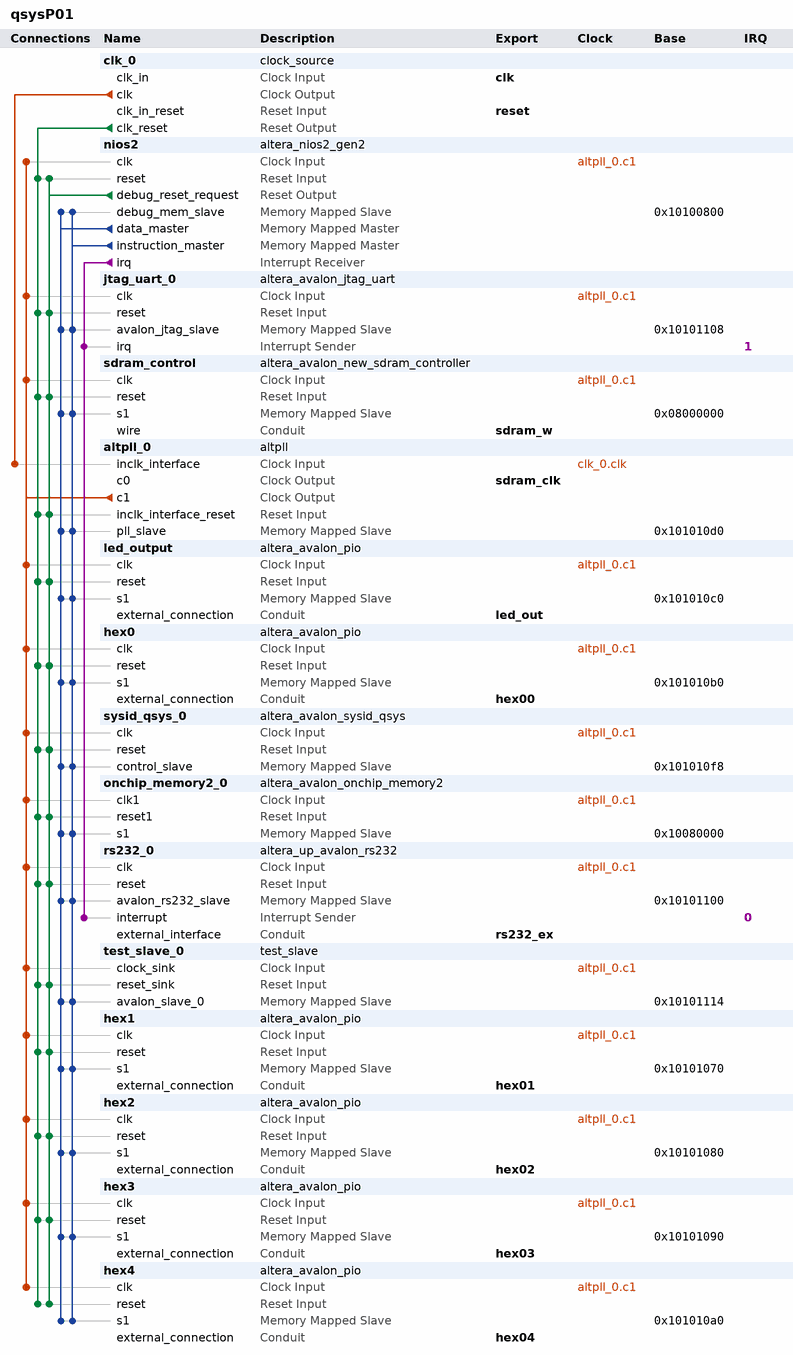
[diagram p0: system contents]
# Platform Designer (Qsys) system qsysP01, Cyclone IV E EP4CE115F29C7
# Parameters at their usual value, and those the tool derives, are not listed.
package require -exact qsys 15.0
create_system qsysP01
set_project_property DEVICE_FAMILY {Cyclone IV E}
set_project_property DEVICE EP4CE115F29C7

add_instance clk_0 clock_source 15.0
set_instance_parameter_value clk_0 clockFrequency 50000000

add_instance nios2 altera_nios2_gen2 15.0
set_instance_parameter_value nios2 dcache_size 2048
set_instance_parameter_value nios2 exceptionSlave onchip_memory2_0.s1
set_instance_parameter_value nios2 icache_size 4096
set_instance_parameter_value nios2 impl Fast
set_instance_parameter_value nios2 resetSlave onchip_memory2_0.s1

add_instance jtag_uart_0 altera_avalon_jtag_uart 15.0
set_instance_parameter_value jtag_uart_0 simInteractiveOptions NO_INTERACTIVE_WINDOWS

add_instance sdram_control altera_avalon_new_sdram_controller 15.0
set_instance_parameter_value sdram_control TAC 5.5
set_instance_parameter_value sdram_control TRCD 20.0
set_instance_parameter_value sdram_control TRP 20.0
set_instance_parameter_value sdram_control casLatency 3
set_instance_parameter_value sdram_control columnWidth 10
set_instance_parameter_value sdram_control dataWidth 32
set_instance_parameter_value sdram_control generateSimulationModel false
set_instance_parameter_value sdram_control model single_Micron_MT48LC4M32B2_7_chip
set_instance_parameter_value sdram_control numberOfBanks 4
set_instance_parameter_value sdram_control numberOfChipSelects 1
set_instance_parameter_value sdram_control powerUpDelay 100.0
set_instance_parameter_value sdram_control refreshPeriod 15.625
set_instance_parameter_value sdram_control rowWidth 13

add_instance altpll_0 altpll 15.0
set_instance_parameter_value altpll_0 CLK0_DIVIDE_BY 2
set_instance_parameter_value altpll_0 CLK0_MULTIPLY_BY 3
set_instance_parameter_value altpll_0 CLK0_PHASE_SHIFT -3000
set_instance_parameter_value altpll_0 CLK1_DIVIDE_BY 2
set_instance_parameter_value altpll_0 CLK1_DUTY_CYCLE 50
set_instance_parameter_value altpll_0 CLK1_MULTIPLY_BY 3
set_instance_parameter_value altpll_0 CLK1_PHASE_SHIFT 0
set_instance_parameter_value altpll_0 INCLK0_INPUT_FREQUENCY 20000
set_instance_parameter_value altpll_0 PORT_ARESET PORT_UNUSED
set_instance_parameter_value altpll_0 PORT_LOCKED PORT_UNUSED
set_instance_parameter_value altpll_0 PORT_clk1 PORT_USED
set_instance_parameter_value altpll_0 PORT_clk2 PORT_UNUSED
set_instance_parameter_value altpll_0 PORT_clk3 PORT_UNUSED

add_instance led_output altera_avalon_pio 15.0
set_instance_parameter_value led_output direction Output
set_instance_parameter_value led_output width 18

add_instance hex0 altera_avalon_pio 15.0
set_instance_parameter_value hex0 direction Output
set_instance_parameter_value hex0 width 7

add_instance sysid_qsys_0 altera_avalon_sysid_qsys 15.0
set_instance_parameter_value sysid_qsys_0 id 0

add_instance onchip_memory2_0 altera_avalon_onchip_memory2 15.0
set_instance_parameter_value onchip_memory2_0 dataWidth 32
set_instance_parameter_value onchip_memory2_0 dualPort false
set_instance_parameter_value onchip_memory2_0 initMemContent true
set_instance_parameter_value onchip_memory2_0 initializationFileName "C:\\Users\\cynthialiu\\Desktop\\project01\\qsys\\software\\nios01\\mem_init\\qsysP01_onchip_memory2_0.hex"
set_instance_parameter_value onchip_memory2_0 memorySize 409600
set_instance_parameter_value onchip_memory2_0 useNonDefaultInitFile true

add_instance rs232_0 altera_up_avalon_rs232 15.0
set_instance_parameter_value rs232_0 baud 115200
set_instance_parameter_value rs232_0 parity None

add_instance test_slave_0 test_slave 1.0
set_instance_parameter_value test_slave_0 DATA_WIDTH 32

add_instance hex1 altera_avalon_pio 15.0
set_instance_parameter_value hex1 direction Output
set_instance_parameter_value hex1 width 7

add_instance hex2 altera_avalon_pio 15.0
set_instance_parameter_value hex2 direction Output
set_instance_parameter_value hex2 width 7

add_instance hex3 altera_avalon_pio 15.0
set_instance_parameter_value hex3 direction Output
set_instance_parameter_value hex3 width 7

add_instance hex4 altera_avalon_pio 15.0
set_instance_parameter_value hex4 direction Output
set_instance_parameter_value hex4 width 7

# connections
add_connection altpll_0.c1 hex0.clk clock
add_connection altpll_0.c1 hex1.clk clock
add_connection altpll_0.c1 hex2.clk clock
add_connection altpll_0.c1 hex3.clk clock
add_connection altpll_0.c1 hex4.clk clock
add_connection altpll_0.c1 jtag_uart_0.clk clock
add_connection altpll_0.c1 led_output.clk clock
add_connection altpll_0.c1 nios2.clk clock
add_connection altpll_0.c1 onchip_memory2_0.clk1 clock
add_connection altpll_0.c1 rs232_0.clk clock
add_connection altpll_0.c1 sdram_control.clk clock
add_connection altpll_0.c1 sysid_qsys_0.clk clock
add_connection altpll_0.c1 test_slave_0.clock_sink clock
add_connection clk_0.clk altpll_0.inclk_interface clock
add_connection clk_0.clk_reset altpll_0.inclk_interface_reset reset
add_connection clk_0.clk_reset hex0.reset reset
add_connection clk_0.clk_reset hex1.reset reset
add_connection clk_0.clk_reset hex2.reset reset
add_connection clk_0.clk_reset hex3.reset reset
add_connection clk_0.clk_reset hex4.reset reset
add_connection clk_0.clk_reset jtag_uart_0.reset reset
add_connection clk_0.clk_reset led_output.reset reset
add_connection clk_0.clk_reset nios2.reset reset
add_connection clk_0.clk_reset onchip_memory2_0.reset1 reset
add_connection clk_0.clk_reset rs232_0.reset reset
add_connection clk_0.clk_reset sdram_control.reset reset
add_connection clk_0.clk_reset sysid_qsys_0.reset reset
add_connection clk_0.clk_reset test_slave_0.reset_sink reset
add_connection nios2.debug_reset_request altpll_0.inclk_interface_reset reset
add_connection nios2.debug_reset_request hex0.reset reset
add_connection nios2.debug_reset_request hex1.reset reset
add_connection nios2.debug_reset_request hex2.reset reset
add_connection nios2.debug_reset_request hex3.reset reset
add_connection nios2.debug_reset_request hex4.reset reset
add_connection nios2.debug_reset_request jtag_uart_0.reset reset
add_connection nios2.debug_reset_request led_output.reset reset
add_connection nios2.debug_reset_request nios2.reset reset
add_connection nios2.debug_reset_request onchip_memory2_0.reset1 reset
add_connection nios2.debug_reset_request rs232_0.reset reset
add_connection nios2.debug_reset_request sdram_control.reset reset
add_connection nios2.debug_reset_request sysid_qsys_0.reset reset
add_connection nios2.debug_reset_request test_slave_0.reset_sink reset
add_connection nios2.data_master altpll_0.pll_slave avalon
set_connection_parameter_value nios2.data_master/altpll_0.pll_slave baseAddress 0x101010d0
add_connection nios2.data_master hex0.s1 avalon
set_connection_parameter_value nios2.data_master/hex0.s1 baseAddress 0x101010b0
add_connection nios2.data_master hex1.s1 avalon
set_connection_parameter_value nios2.data_master/hex1.s1 baseAddress 0x10101070
add_connection nios2.data_master hex2.s1 avalon
set_connection_parameter_value nios2.data_master/hex2.s1 baseAddress 0x10101080
add_connection nios2.data_master hex3.s1 avalon
set_connection_parameter_value nios2.data_master/hex3.s1 baseAddress 0x10101090
add_connection nios2.data_master hex4.s1 avalon
set_connection_parameter_value nios2.data_master/hex4.s1 baseAddress 0x101010a0
add_connection nios2.data_master jtag_uart_0.avalon_jtag_slave avalon
set_connection_parameter_value nios2.data_master/jtag_uart_0.avalon_jtag_slave baseAddress 0x10101108
add_connection nios2.data_master led_output.s1 avalon
set_connection_parameter_value nios2.data_master/led_output.s1 baseAddress 0x101010c0
add_connection nios2.data_master nios2.debug_mem_slave avalon
set_connection_parameter_value nios2.data_master/nios2.debug_mem_slave baseAddress 0x10100800
add_connection nios2.data_master onchip_memory2_0.s1 avalon
set_connection_parameter_value nios2.data_master/onchip_memory2_0.s1 baseAddress 0x10080000
add_connection nios2.data_master rs232_0.avalon_rs232_slave avalon
set_connection_parameter_value nios2.data_master/rs232_0.avalon_rs232_slave baseAddress 0x10101100
add_connection nios2.data_master sdram_control.s1 avalon
set_connection_parameter_value nios2.data_master/sdram_control.s1 baseAddress 0x08000000
add_connection nios2.data_master sysid_qsys_0.control_slave avalon
set_connection_parameter_value nios2.data_master/sysid_qsys_0.control_slave baseAddress 0x101010f8
add_connection nios2.data_master test_slave_0.avalon_slave_0 avalon
set_connection_parameter_value nios2.data_master/test_slave_0.avalon_slave_0 baseAddress 0x10101114
add_connection nios2.instruction_master altpll_0.pll_slave avalon
set_connection_parameter_value nios2.instruction_master/altpll_0.pll_slave baseAddress 0x101010d0
add_connection nios2.instruction_master hex0.s1 avalon
set_connection_parameter_value nios2.instruction_master/hex0.s1 baseAddress 0x101010b0
add_connection nios2.instruction_master hex1.s1 avalon
set_connection_parameter_value nios2.instruction_master/hex1.s1 baseAddress 0x10101070
add_connection nios2.instruction_master hex2.s1 avalon
set_connection_parameter_value nios2.instruction_master/hex2.s1 baseAddress 0x10101080
add_connection nios2.instruction_master hex3.s1 avalon
set_connection_parameter_value nios2.instruction_master/hex3.s1 baseAddress 0x10101090
add_connection nios2.instruction_master hex4.s1 avalon
set_connection_parameter_value nios2.instruction_master/hex4.s1 baseAddress 0x101010a0
add_connection nios2.instruction_master jtag_uart_0.avalon_jtag_slave avalon
set_connection_parameter_value nios2.instruction_master/jtag_uart_0.avalon_jtag_slave baseAddress 0x10101108
add_connection nios2.instruction_master led_output.s1 avalon
set_connection_parameter_value nios2.instruction_master/led_output.s1 baseAddress 0x101010c0
add_connection nios2.instruction_master nios2.debug_mem_slave avalon
set_connection_parameter_value nios2.instruction_master/nios2.debug_mem_slave baseAddress 0x10100800
add_connection nios2.instruction_master onchip_memory2_0.s1 avalon
set_connection_parameter_value nios2.instruction_master/onchip_memory2_0.s1 baseAddress 0x10080000
add_connection nios2.instruction_master rs232_0.avalon_rs232_slave avalon
set_connection_parameter_value nios2.instruction_master/rs232_0.avalon_rs232_slave baseAddress 0x10101100
add_connection nios2.instruction_master sdram_control.s1 avalon
set_connection_parameter_value nios2.instruction_master/sdram_control.s1 baseAddress 0x08000000
add_connection nios2.instruction_master sysid_qsys_0.control_slave avalon
set_connection_parameter_value nios2.instruction_master/sysid_qsys_0.control_slave baseAddress 0x101010f8
add_connection nios2.instruction_master test_slave_0.avalon_slave_0 avalon
set_connection_parameter_value nios2.instruction_master/test_slave_0.avalon_slave_0 baseAddress 0x10101114
add_connection nios2.irq jtag_uart_0.irq interrupt
set_connection_parameter_value nios2.irq/jtag_uart_0.irq irqNumber 1
add_connection nios2.irq rs232_0.interrupt interrupt
set_connection_parameter_value nios2.irq/rs232_0.interrupt irqNumber 0

# exported interfaces
add_interface clk clock sink
set_interface_property clk EXPORT_OF clk_0.clk_in
add_interface hex00 conduit end
set_interface_property hex00 EXPORT_OF hex0.external_connection
add_interface hex01 conduit end
set_interface_property hex01 EXPORT_OF hex1.external_connection
add_interface hex02 conduit end
set_interface_property hex02 EXPORT_OF hex2.external_connection
add_interface hex03 conduit end
set_interface_property hex03 EXPORT_OF hex3.external_connection
add_interface hex04 conduit end
set_interface_property hex04 EXPORT_OF hex4.external_connection
add_interface led_out conduit end
set_interface_property led_out EXPORT_OF led_output.external_connection
add_interface reset reset sink
set_interface_property reset EXPORT_OF clk_0.clk_in_reset
add_interface rs232_ex conduit end
set_interface_property rs232_ex EXPORT_OF rs232_0.external_interface
add_interface sdram_clk clock source
set_interface_property sdram_clk EXPORT_OF altpll_0.c0
add_interface sdram_w conduit end
set_interface_property sdram_w EXPORT_OF sdram_control.wire

set_interconnect_requirement {$system} qsys_mm.clockCrossingAdapter HANDSHAKE
set_interconnect_requirement {$system} qsys_mm.enableEccProtection FALSE
set_interconnect_requirement {$system} qsys_mm.insertDefaultSlave FALSE
set_interconnect_requirement {$system} qsys_mm.maxAdditionalLatency 1

save_system qsysP01.qsys
